# EAGLE design Macropad (EAGLE 9.6.2)
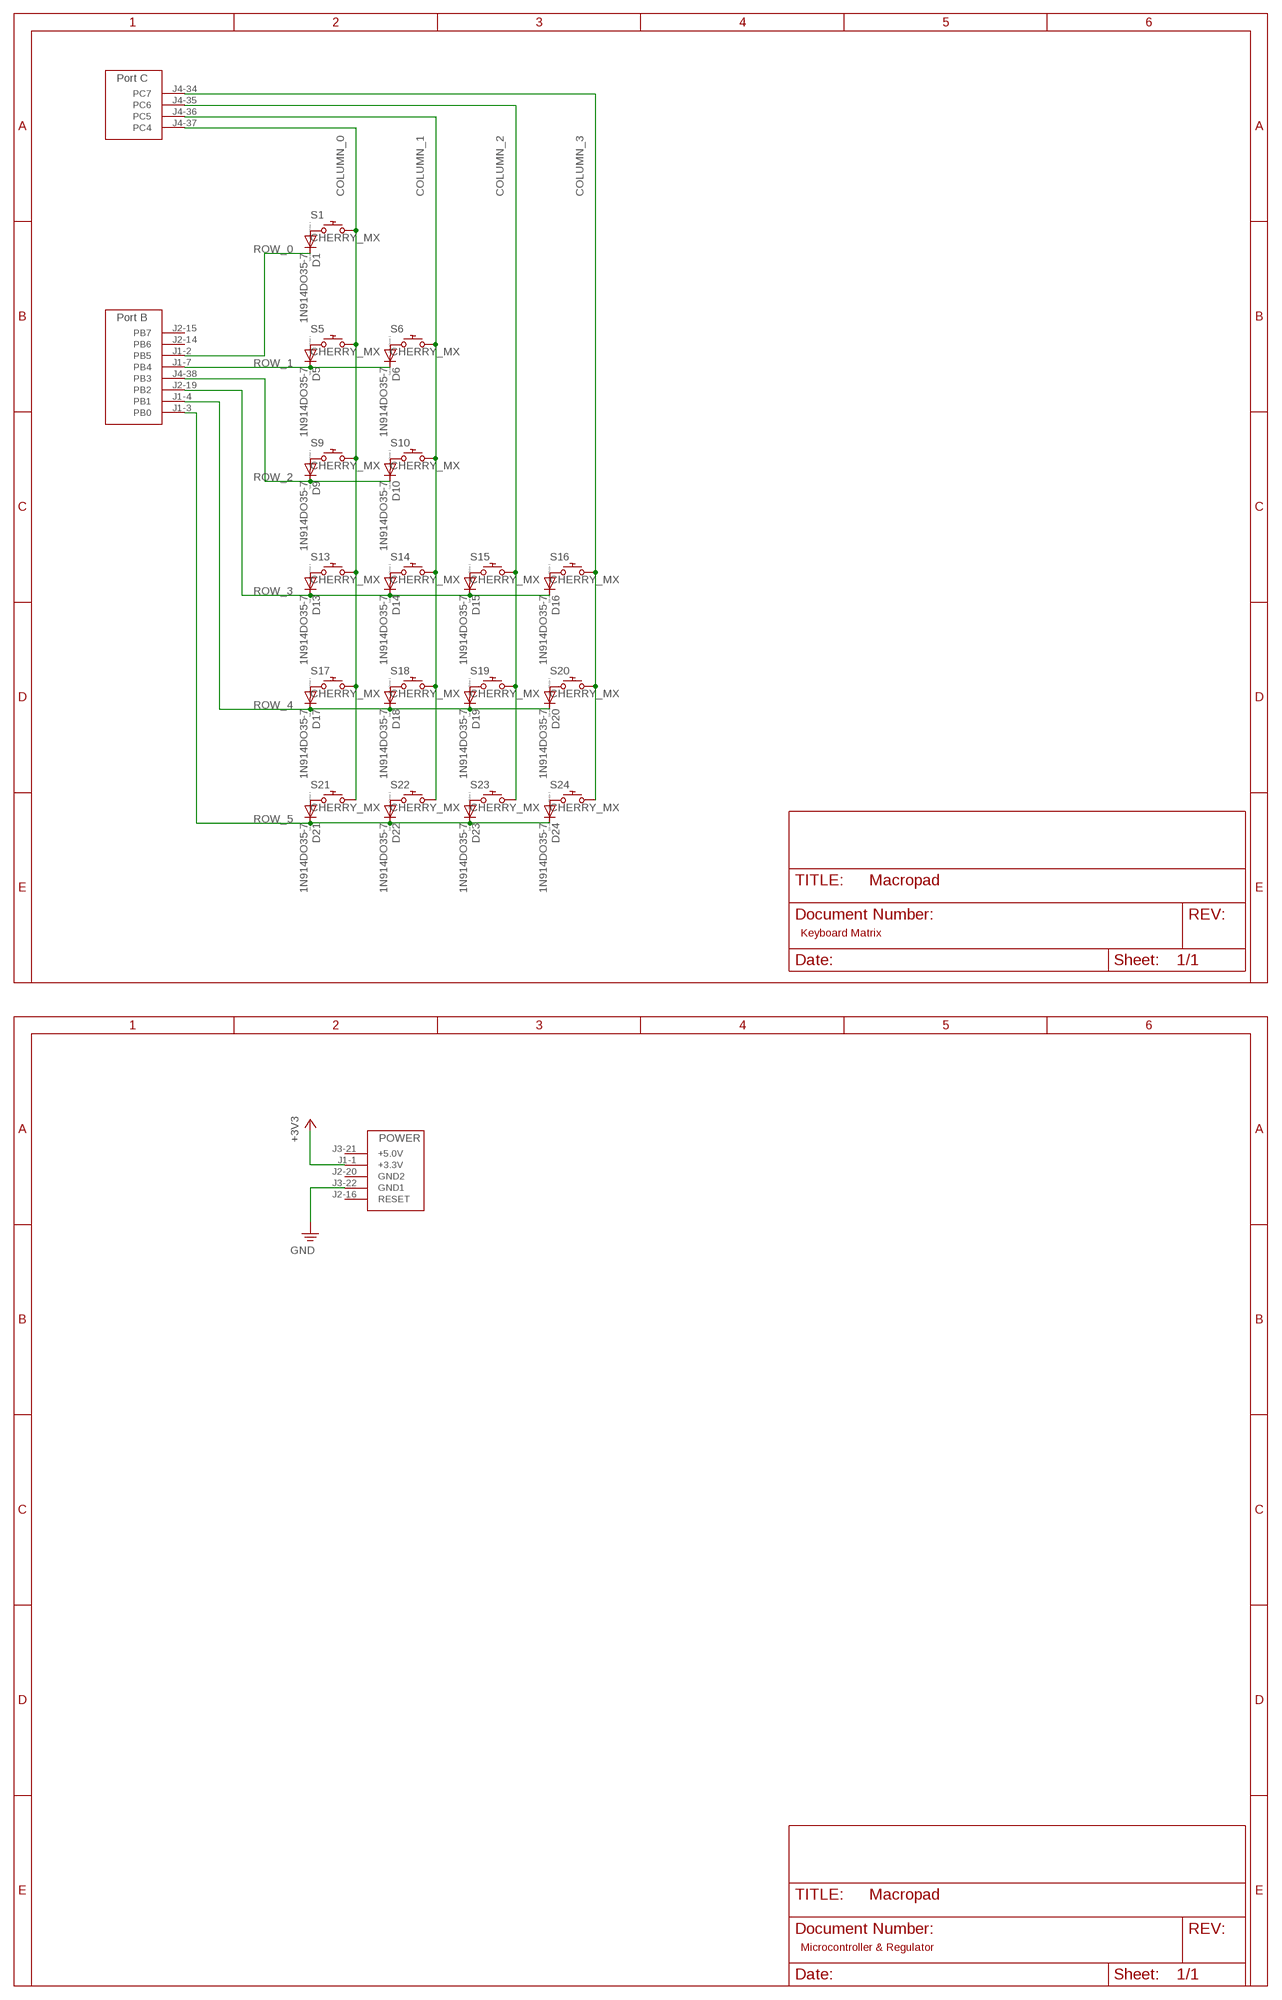
[diagram p0: schematic, sheet 1, part 1 of 2]
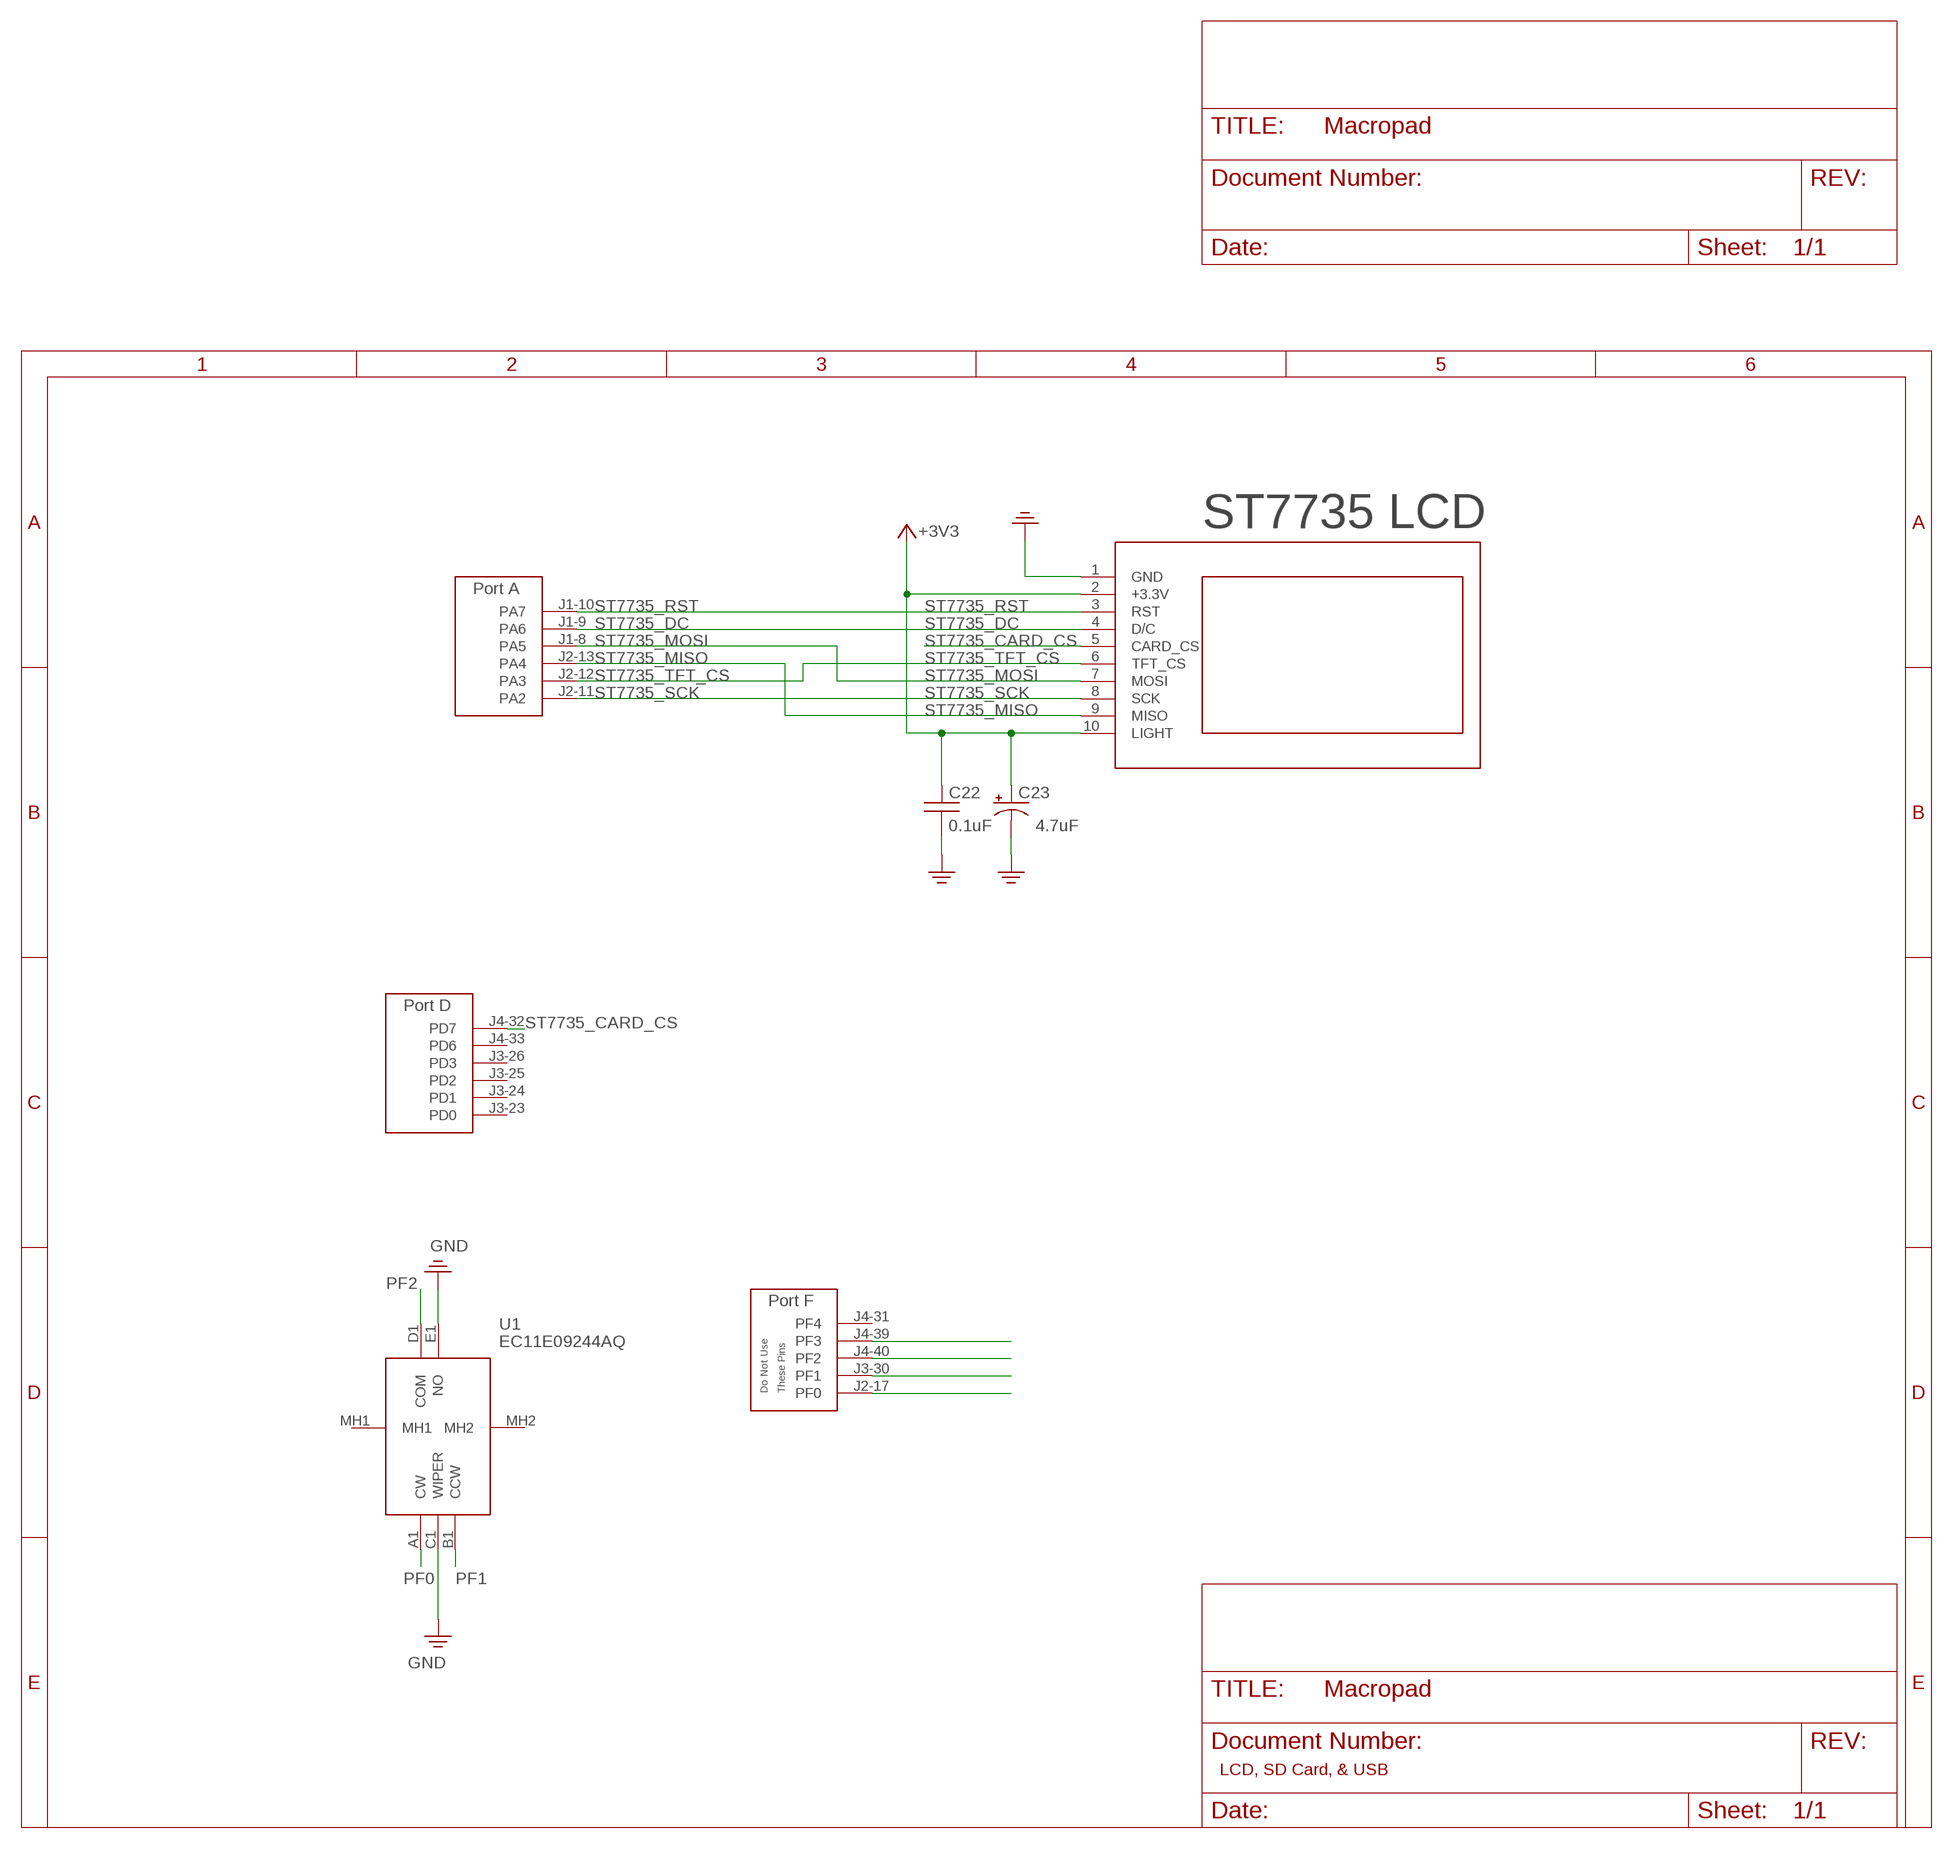
[diagram p1: schematic, sheet 1, part 2 of 2]

## Parts
C22  0.1uF  CAPACITOR050-024X044  [CAP200MIL]
C23  4.7uF  CAPACITOR_POLARIZEDE5-6  [CAP200MILPOLARIZED]
D1  1N914DO35-7  [DO35-7]
D5  1N914DO35-7  [DO35-7]
D6  1N914DO35-7  [DO35-7]
D9  1N914DO35-7  [DO35-7]
D10  1N914DO35-7  [DO35-7]
D13  1N914DO35-7  [DO35-7]
D14  1N914DO35-7  [DO35-7]
D15  1N914DO35-7  [DO35-7]
D16  1N914DO35-7  [DO35-7]
D17  1N914DO35-7  [DO35-7]
D18  1N914DO35-7  [DO35-7]
D19  1N914DO35-7  [DO35-7]
D20  1N914DO35-7  [DO35-7]
D21  1N914DO35-7  [DO35-7]
D22  1N914DO35-7  [DO35-7]
D23  1N914DO35-7  [DO35-7]
D24  1N914DO35-7  [DO35-7]
S1  CHERRY_MX  [CHERRY_MX]
S5  CHERRY_MX  [CHERRY_MX]
S6  CHERRY_MX  [CHERRY_MX]
S9  CHERRY_MX  [CHERRY_MX]
S10  CHERRY_MX  [CHERRY_MX]
S13  CHERRY_MX  [CHERRY_MX]
S14  CHERRY_MX  [CHERRY_MX]
S15  CHERRY_MX  [CHERRY_MX]
S16  CHERRY_MX  [CHERRY_MX]
S17  CHERRY_MX  [CHERRY_MX]
S18  CHERRY_MX  [CHERRY_MX]
S19  CHERRY_MX  [CHERRY_MX]
S20  CHERRY_MX  [CHERRY_MX]
S21  CHERRY_MX  [CHERRY_MX]
S22  CHERRY_MX  [CHERRY_MX]
S23  CHERRY_MX  [CHERRY_MX]
S24  CHERRY_MX  [CHERRY_MX]
U1  EC11E09244AQ  [EC11E09244AQ]
U$2  TM4C_BP  [TM4C_BOOSTER_PACK]
U$6  ST7735  [ST7735]

## Nets
+3V3: C22.1 C23.+ U$2.J1-1(+3.3V) U$6.2(+3.3V) U$6.10(LIGHT)
COLUMN_0: S1.S2 S5.S2 S9.S2 S13.S2 S17.S2 S21.S2 U$2.J4-37(PC4)
COLUMN_1: S6.S2 S10.S2 S14.S2 S18.S2 S22.S2 U$2.J4-36(PC5)
COLUMN_2: S15.S2 S19.S2 S23.S2 U$2.J4-35(PC6)
COLUMN_3: S16.S2 S20.S2 S24.S2 U$2.J4-34(PC7)
GND: C22.2 C23.- U1.C1(WIPER) U1.E1(NO) U$2.J3-22(GND1) U$6.1(GND)
N$3: D1.A S1.S1
N$11: D5.A S5.S1
N$12: D6.A S6.S1
N$15: D9.A S9.S1
N$16: D10.A S10.S1
N$19: D13.A S13.S1
N$20: D14.A S14.S1
N$21: D15.A S15.S1
N$22: D16.A S16.S1
N$23: D17.A S17.S1
N$24: D18.A S18.S1
N$25: D19.A S19.S1
N$26: D20.A S20.S1
N$27: D21.A S21.S1
N$28: D22.A S22.S1
N$29: D23.A S23.S1
N$30: D24.A S24.S1
PF0: U1.A1(CW) U$2.J2-17(PF0)
PF1: U1.B1(CCW) U$2.J3-30(PF1)
PF2: U1.D1(COM) U$2.J4-40(PF2)
PF3: U$2.J4-39(PF3)
ROW_0: D1.C U$2.J1-2(PB5)
ROW_1: D5.C D6.C U$2.J1-7(PB4)
ROW_2: D9.C D10.C U$2.J4-38(PB3)
ROW_3: D13.C D14.C D15.C D16.C U$2.J2-19(PB2)
ROW_4: D17.C D18.C D19.C D20.C U$2.J1-4(PB1)
ROW_5: D21.C D22.C D23.C D24.C U$2.J1-3(PB0)
ST7735_CARD_CS: U$2.J4-32(PD7) U$6.5(CARD_CS)
ST7735_DC: U$2.J1-9(PA6) U$6.4(D/C)
ST7735_MISO: U$2.J2-13(PA4) U$6.9(MISO)
ST7735_MOSI: U$2.J1-8(PA5) U$6.7(MOSI)
ST7735_RST: U$2.J1-10(PA7) U$6.3(RST)
ST7735_SCK: U$2.J2-11(PA2) U$6.8(SCK)
ST7735_TFT_CS: U$2.J2-12(PA3) U$6.6(TFT_CS)
Unconnected: U1.MH1 U1.MH2 U$2.J1-5(PE4) U$2.J1-6(PE5) U$2.J2-14(PB6) U$2.J2-15(PB7) U$2.J2-16(RESET) U$2.J2-18(PE0) U$2.J2-20(GND2) U$2.J3-21(+5.0V) U$2.J3-23(PD0) U$2.J3-24(PD1) U$2.J3-25(PD2) U$2.J3-26(PD3) U$2.J3-27(PE1) U$2.J3-28(PE2) U$2.J3-29(PE3) U$2.J4-31(PF4) U$2.J4-33(PD6)

## Notes on the sheet
- Keyboard Matrix
- ST7735 LCD
- Microcontroller & Regulator | LCD, SD Card, & USB

## Library data of the parts
C22 = EE445L:CAPACITOR: CAPACITOR, American symbol
C23 = EE445L:CAPACITOR_POLARIZED: POLARIZED CAPACITOR, American symbol
D1 D5 D6 D9 D10 D13-D24 = EE445L:1N914: DIODE high speed (Philips) 1N914
S1 S5 S6 S9 S10 S13-S24 = cherry:CHERRY_MX: Cherry keymodule MX; FARNELL: 2292961; MOUSER: 540-MX1A-11NW
U1 = SamacSys_Parts:EC11E09244AQ: Encoders 11mm 9 res 18 detent w/ switch lo profile Source: Datasheet <https://componentsearchengine.com/Datasheets/2/EC11E09244AQ.pdf>; DESCRIPTION: Encoders 11mm 9 res 18 detent w/ switch lo profile; HEIGHT: 24.5mm; MANUFACTURER_NAME: Alps Alpine; MANUFACTURER_PART_NUMBER: EC11E09244AQ; MOUSER_PART_NUMBER: 688-EC11E09244AQ; MOUSER_PRICE-STOCK: https://www.mouser.co.uk/ProductDetail/Alps-Alpine/EC11E09244AQ?qs=fMKjfF2mFohVUA4%2Ftyw7NQ%3D%3D
U$2 = EE445L:TM4C_BP
U$6 = EE445L:ST7735

## Board
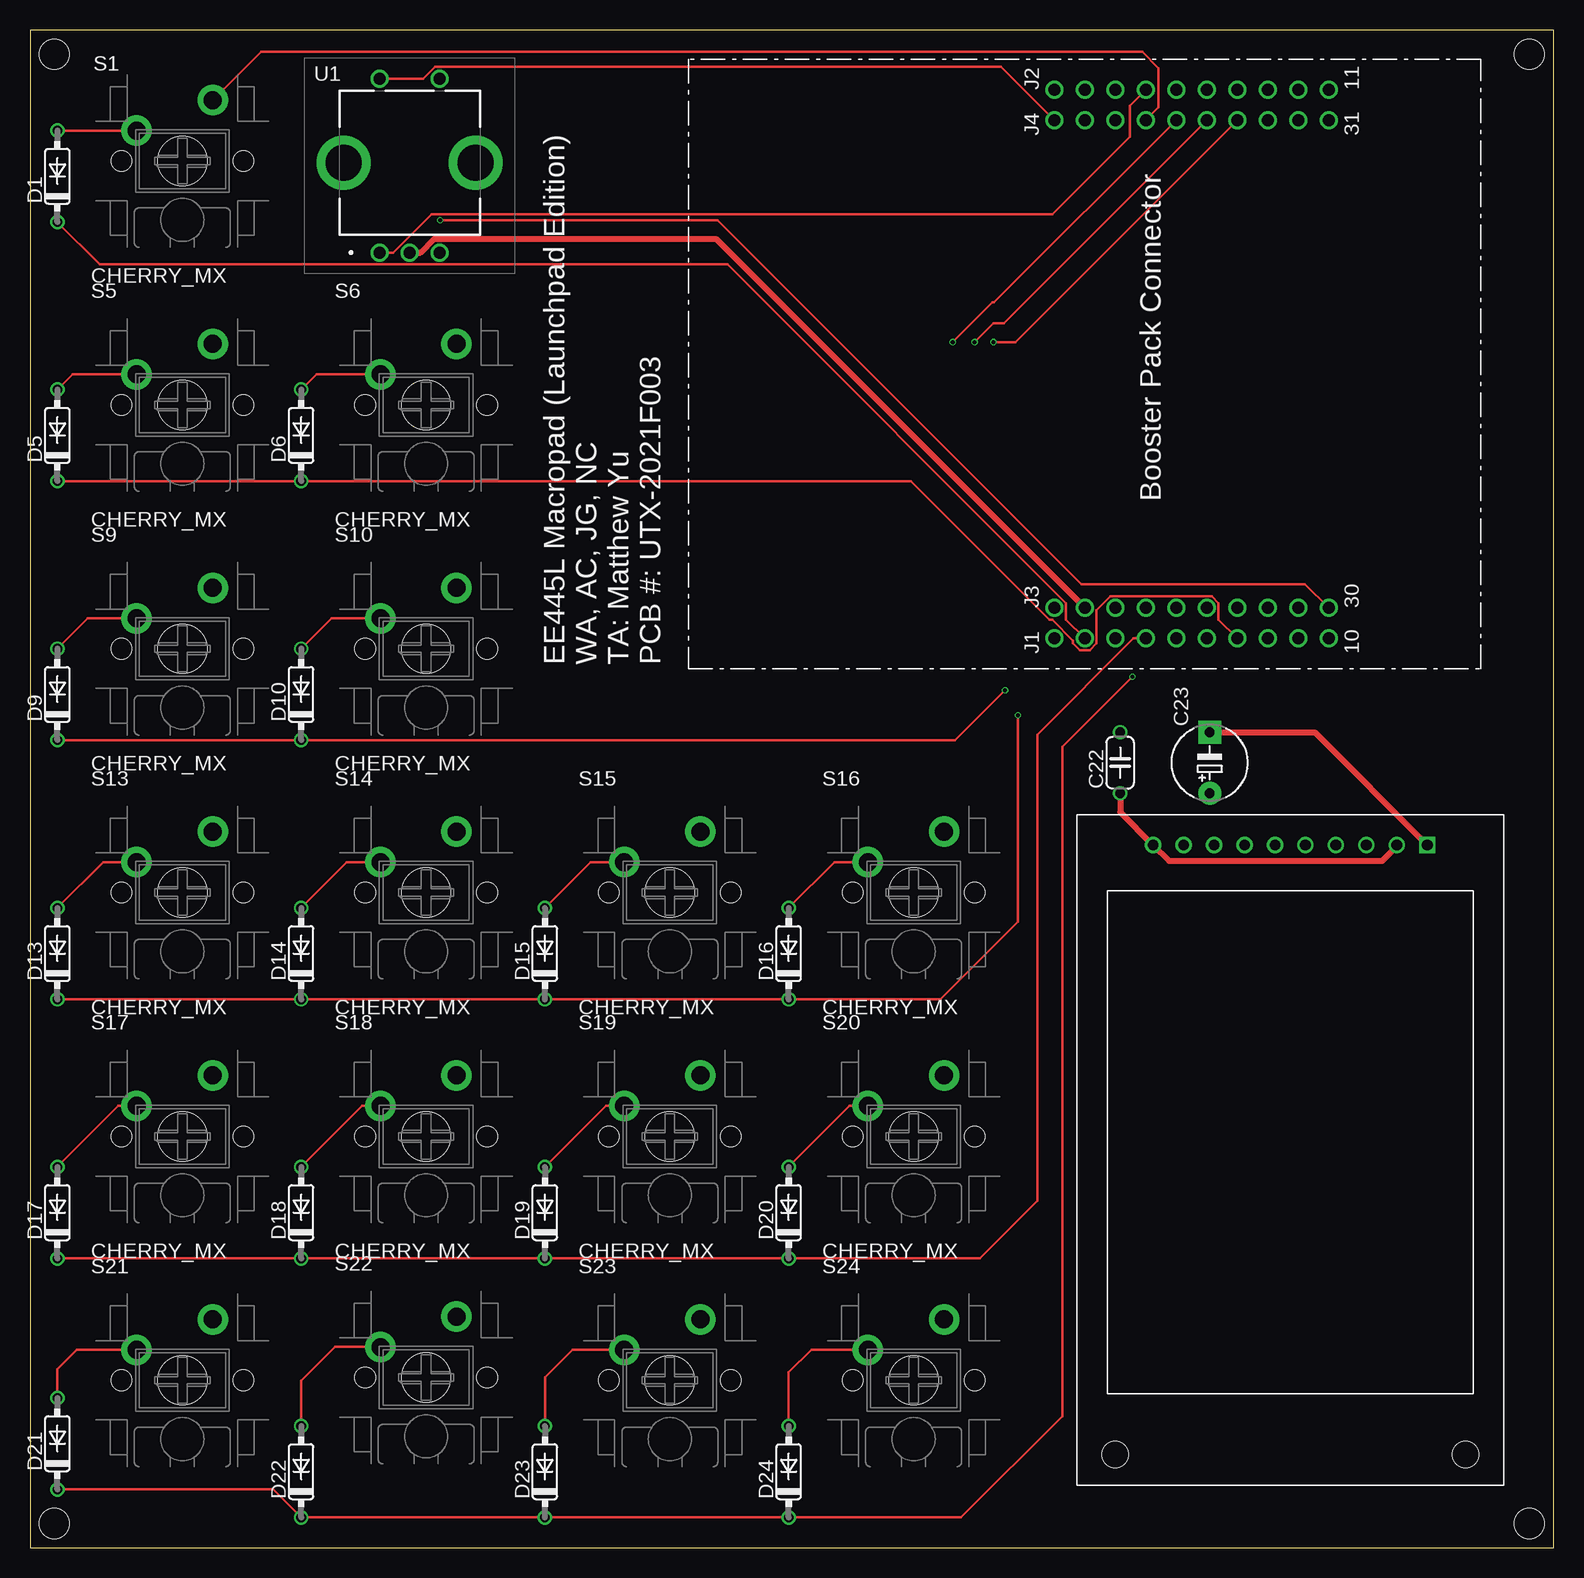
[diagram p2: board, top side]
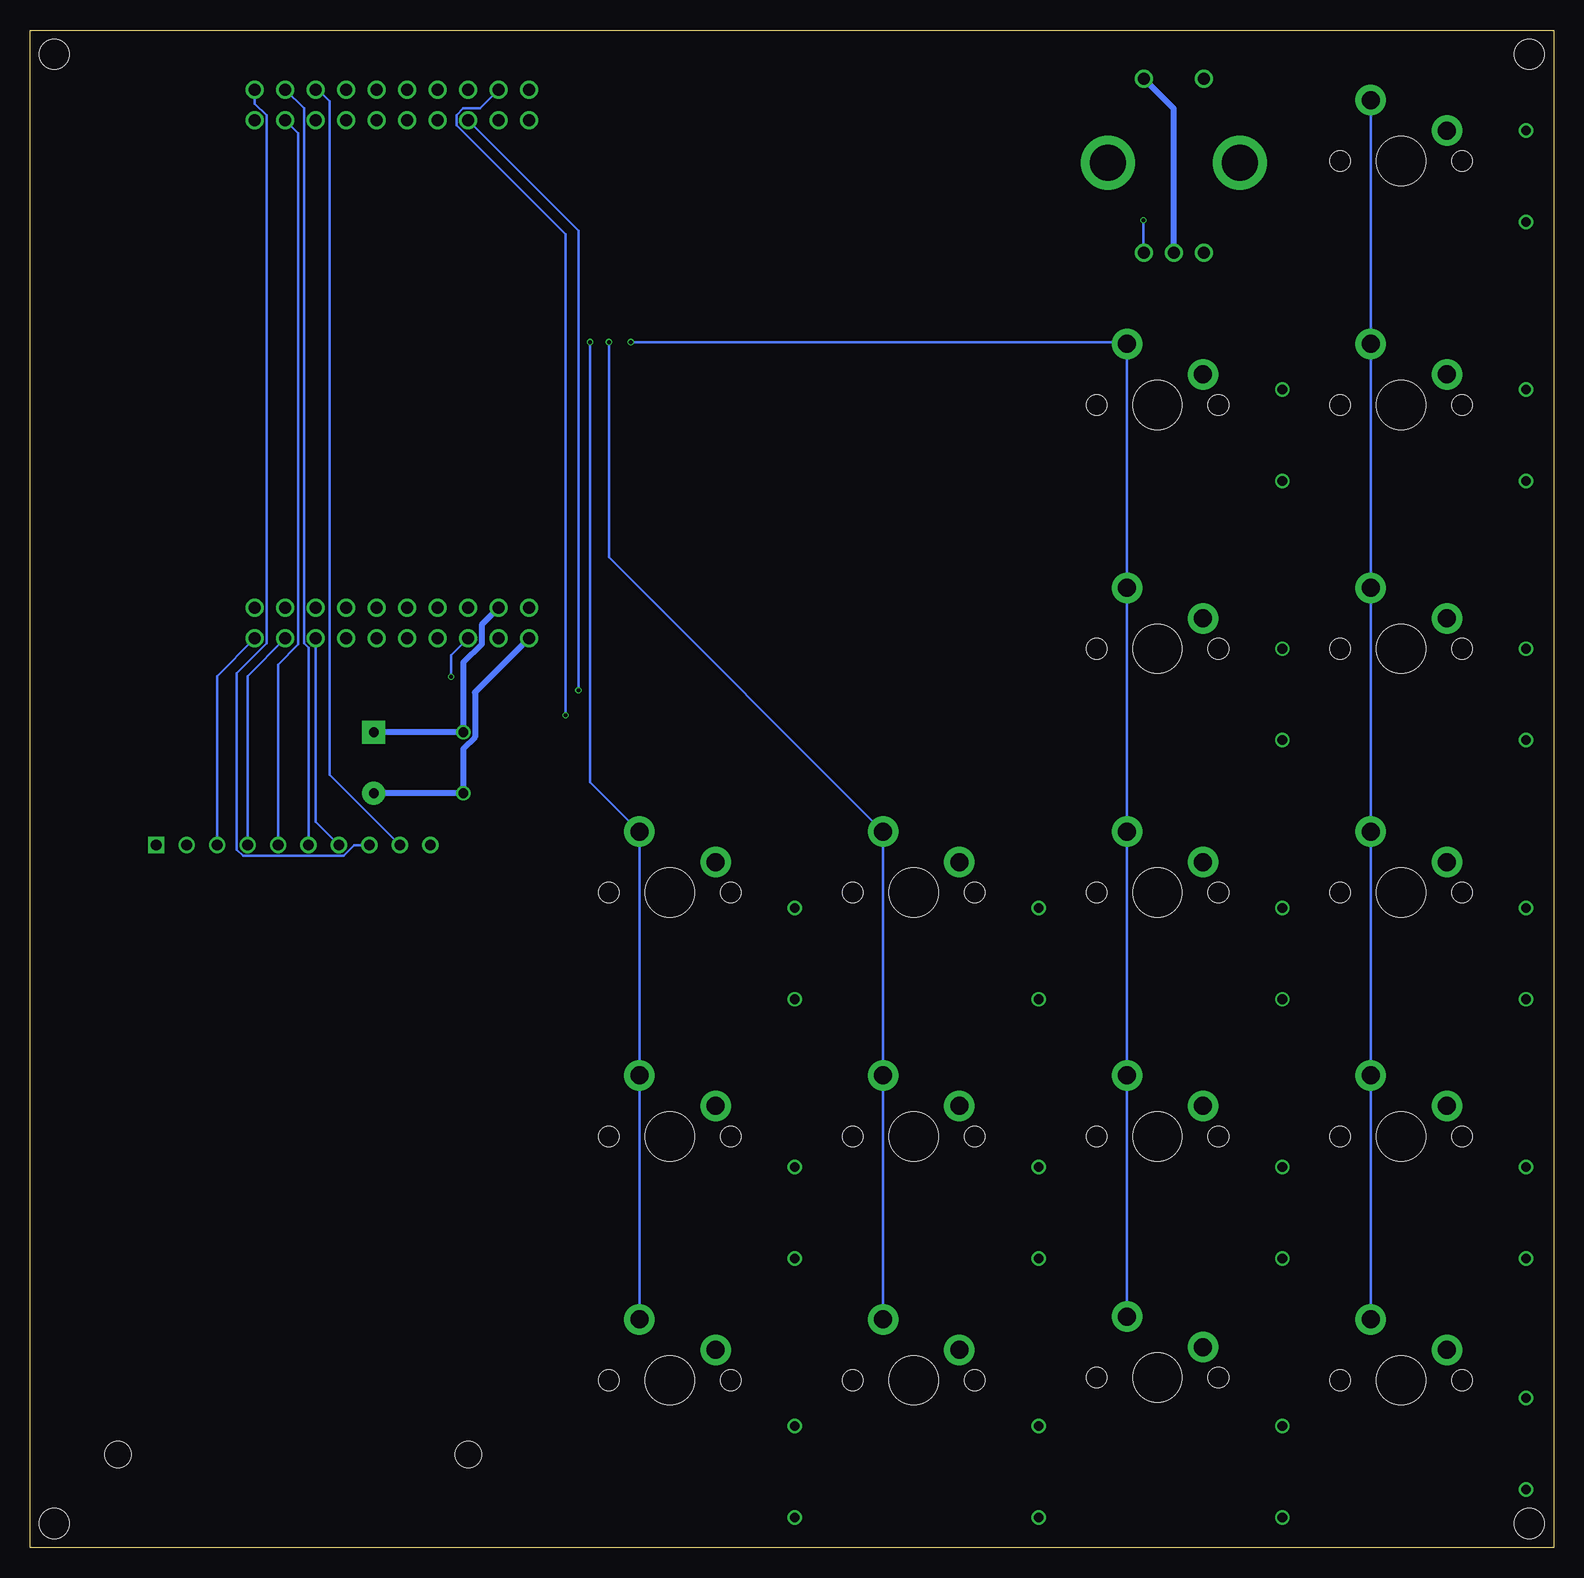
[diagram p3: board, bottom side, seen from below]

Size 127 x 126.49 mm. Coordinates in mm from the lower left corner, seen from the top.
Outline: 0,0 127,0 127,126.49 0,126.49 0,0
Copper layers (1*16): Top 0.035559375mm / dielectric 1.6mm / Bottom 0.035559375mm
Design rules "jlcpcb2layer": minimum track width 5mil, minimum drill 12mil, track to track 5mil, track to pad 5mil, pad to pad 5mil, via to via 5mil, smd to smd 5mil, copper to edge 8mil, drill to drill 6mil, minimum pad ring 5mil, minimum via ring 3mil, stop-mask expansion 2.5mil, vias tented up to drill 0mil, thermal gap 10mil
Holes 2.5 mm at 124.97,124.46 124.97,2.03 2.03,2.03 2.03,124.46

### Footprints (pad centres in the part's own frame; a part is rotated, then mirrored left to right if it is on the bottom)
CAP200MIL = drill 0.8: 1 -2.54,0; 2 2.54,0
CAP200MILPOLARIZED = drill 0.8 pad 1.905: + -2.54,0 | drill 0.8 pad 1.905 square: - 2.54,0
DO35-7 = drill 0.8: A 3.81,0; C -3.81,0
CHERRY_MX = drill 1.5 pad 2.54: S1 -3.81,2.54; S2 2.54,5.08 | hole 1.7: -5.08,0; 5.08,0 | hole 4.1: 0,0
EC11E09244AQ = drill 1 pad 1.5: A1 0,0; B1 5,0; C1 2.5,0; D1 0,14.5; E1 5,14.5 | drill 3 pad 4.5: MH1 -3,7.5; MH2 8,7.5
TM4C_BOOSTER_PACK = drill 1: J1-1 0,22.86; J1-2 0,20.32; J1-3 0,17.78; J1-4 0,15.24; J1-5 0,12.7; J1-6 0,10.16; J1-7 0,7.62; J1-8 0,5.08; J1-9 0,2.54; J1-10 0,0; J2-11 45.72,0; J2-12 45.72,2.54; J2-13 45.72,5.08; J2-14 45.72,7.62; J2-15 45.72,10.16; J2-16 45.72,12.7; J2-17 45.72,15.24; J2-18 45.72,17.78; J2-19 45.72,20.32; J2-20 45.72,22.86; J3-21 2.54,22.86; J3-22 2.54,20.32; J3-23 2.54,17.78; J3-24 2.54,15.24; J3-25 2.54,12.7; J3-26 2.54,10.16; J3-27 2.54,7.62; J3-28 2.54,5.08; J3-29 2.54,2.54; J3-30 2.54,0; J4-31 43.18,0; J4-32 43.18,2.54; J4-33 43.18,5.08; J4-34 43.18,7.62; J4-35 43.18,10.16; J4-36 43.18,12.7; J4-37 43.18,15.24; J4-38 43.18,17.78; J4-39 43.18,20.32; J4-40 43.18,22.86
ST7735 = drill 0.9 square: 1 0,0 | drill 0.9: 2 0,-2.54; 3 0,-5.08; 4 0,-7.62; 5 0,-10.16; 6 0,-12.7; 7 0,-15.24; 8 0,-17.78; 9 0,-20.32; 10 0,-22.86 | hole 2.184: 50.8,3.175; 50.8,-26.035

### Placement (x,y rotation side)
C22  90.88,65.43 90 top
C23  98.35,65.43 90 top
D1  2.29,114.3 90 top
D5  2.29,92.71 90 top
D6  22.61,92.71 90 top
D9  2.29,71.12 90 top
D10  22.61,71.12 90 top
D13  2.29,49.53 90 top
D14  22.61,49.53 90 top
D15  42.93,49.53 90 top
D16  63.25,49.53 90 top
D17  2.29,27.94 90 top
D18  22.61,27.94 90 top
D19  42.93,27.94 90 top
D20  63.25,27.94 90 top
D21  2.29,8.69 90 top
D22  22.61,6.35 90 top
D23  42.93,6.35 90 top
D24  63.25,6.35 90 top
S1  12.7,115.57 0 top
S5  12.7,95.25 0 top
S6  33.02,95.25 0 top
S9  12.7,74.93 0 top
S10  33.02,74.93 0 top
S13  12.7,54.61 0 top
S14  33.02,54.61 0 top
S15  53.34,54.61 0 top
S16  73.66,54.61 0 top
S17  12.7,34.29 0 top
S18  33.02,34.29 0 top
S19  53.34,34.29 0 top
S20  73.66,34.29 0 top
S21  12.7,13.97 0 top
S22  33.02,14.2 0 top
S23  53.34,13.97 0 top
S24  73.66,13.97 0 top
U1  29.16,107.95 0 top
U$2  108.25,75.79 90 top
U$6  116.48,58.57 270 top

### Tracks (layer width: path | path; a pad name or v marks a point on that pad's centre or on a via)
+3V3
  Top 0.508: C22.1 90.88,61.32 U$6.10 94.94,57.25 112.72,57.25 113.94,58.47 U$6.2
  Bottom 0.508: C23.+ C22.1 90.88,66.58 89.9,67.56 89.9,71.29 U$2.J1-1
COLUMN_0
  Top 0.203: U$2.J4-37 94.08,120.04 94.08,123.29 92.71,124.66 19.25,124.66 S1.S2
  Bottom 0.203: S1.S2 S5.S2 S9.S2 S13.S2 S17.S2 S21.S2
COLUMN_1  (via drill 0.35)
  Top 0.203: U$2.J4-36 80.37,103.78 80.21,103.78 v76.91,100.48
  Bottom 0.203: S22.S2 S18.S2 S14.S2 S10.S2 S6.S2 35.71,100.48 v76.91,100.48
COLUMN_2  (via drill 0.35)
  Top 0.203: U$2.J4-35 81.18,102.06 80.31,102.06 v78.74,100.48
  Bottom 0.203: S23.S2 S19.S2 S15.S2 78.74,82.55 v78.74,100.48
COLUMN_3  (via drill 0.35)
  Top 0.203: U$2.J4-34 82.14,100.48 v80.31,100.48
  Bottom 0.203: S24.S2 S20.S2 S16.S2 80.31,63.8 v80.31,100.48
GND
  Top 0.508: C23.- 107.09,67.97 U$6.1 | U1.C1 32.56,107.95 33.69,109.08 57.19,109.08 U$2.J3-22
  Bottom 0.508: C23.- C22.2 90.88,73.79 89.34,75.33 89.34,76.92 U$2.J3-22 | U1.C1 31.66,119.95 U1.E1
N$3
  Top 0.203: D1.A S1.S1
N$11
  Top 0.203: D5.A 3.56,97.79 S5.S1
N$12
  Top 0.203: D6.A 23.88,97.79 S6.S1
N$15
  Top 0.203: D9.A 4.83,77.47 S9.S1
N$16
  Top 0.203: D10.A 25.15,77.47 S10.S1
N$19
  Top 0.203: D13.A 6.1,57.15 S13.S1
N$20
  Top 0.203: D14.A 26.42,57.15 S14.S1
N$21
  Top 0.203: D15.A 46.74,57.15 S15.S1
N$22
  Top 0.203: D16.A 67.06,57.15 S16.S1
N$23
  Top 0.203: D17.A 7.37,36.83 S17.S1
N$24
  Top 0.203: D18.A 27.69,36.83 S18.S1
N$25
  Top 0.203: D19.A 48.01,36.83 S19.S1
N$26
  Top 0.203: D20.A 68.33,36.83 S20.S1
N$27
  Top 0.203: D21.A 2.29,14.88 3.91,16.51 S21.S1
N$28
  Top 0.203: D22.A 22.61,13.92 25.45,16.76 29.18,16.76 S22.S1
N$29
  Top 0.203: D23.A 42.93,14.22 45.21,16.51 S23.S1
N$30
  Top 0.203: D24.A 63.25,14.63 65.13,16.51 S24.S1
PF0
  Top 0.203: U$2.J2-17 91.69,120.19 91.69,117.6 85.22,111.13 33.46,111.13 30.27,107.95 U1.A1
PF1  (via drill 0.35)
  Top 0.203: U$2.J3-30 106.27,80.31 87.63,80.31 57.3,110.64 v34.19,110.64
  Bottom 0.203: v34.19,110.64 34.19,107.98 U1.B1
PF2
  Top 0.203: U1.D1 32.77,122.45 33.75,123.43 80.94,123.43 U$2.J4-40
ROW_0
  Top 0.203: U$2.J1-2 86.37,77.36 86.37,78.74 58.14,106.97 5.8,106.97 D1.C
ROW_1
  Top 0.203: D5.C D6.C 73.44,88.9 84.99,77.36 85.22,77.36 86.96,75.62 86.96,75.39 87.53,74.81 88.34,74.81 88.91,75.39 88.91,78.16 90.07,79.31 98.5,79.31 99.07,78.74 99.07,77.36 U$2.J1-7
ROW_2  (via drill 0.35)
  Top 0.203: D9.C D10.C 77.11,67.31 v81.28,71.48
  Bottom 0.203: v81.28,71.48 81.28,109.78 U$2.J4-38
ROW_3  (via drill 0.35)
  Top 0.203: D13.C D14.C D15.C D16.C 75.89,45.72 82.35,52.17 v82.35,69.39
  Bottom 0.203: v82.35,69.39 82.35,109.46 91.45,118.57 91.45,119.38 90.88,119.95 89.5,119.95 U$2.J2-19
ROW_4
  Top 0.203: D17.C D18.C D19.C D20.C 79.21,24.13 83.99,28.91 83.99,67.78 92,75.79 U$2.J1-4
ROW_5  (via drill 0.35)
  Top 0.203: D21.C 20.27,4.88 D22.C D23.C D24.C 77.62,2.54 86.06,10.97 86.06,66.75 v91.9,72.59
  Bottom 0.203: U$2.J1-3 91.9,74.37 v91.9,72.59
ST7735_CARD_CS
  Bottom 0.203: U$6.5 106.32,73.61 104.65,75.29 104.65,117.91 U$2.J4-32
ST7735_DC
  Bottom 0.203: U$2.J1-9 108.86,72.64 U$6.4
ST7735_MISO
  Bottom 0.203: U$6.9 102.01,64.41 102.01,120.55 102.97,121.51 U$2.J2-13
ST7735_MOSI
  Bottom 0.203: U$2.J1-8 103.17,60.5 U$6.7
ST7735_RST
  Bottom 0.203: U$2.J1-10 111.4,72.64 U$6.3
ST7735_SCK
  Bottom 0.203: U$2.J2-11 108.25,120.36 107.28,119.38 107.28,75.39 109.77,72.9 109.77,58.2 109.24,57.67 100.87,57.67 99.97,58.57 U$6.8
ST7735_TFT_CS
  Bottom 0.203: U$6.6 103.78,75.02 104.15,75.39 104.15,119.95 U$2.J2-12

### Text on the board
tPlace: EE445L Macropad (Launchpad Edition) / WA, AC, JG, NC / TA: Matthew Yu / PCB #: UTX-2021F003